# EAGLE design WeMos D1 mini (EAGLE 8.3.2)
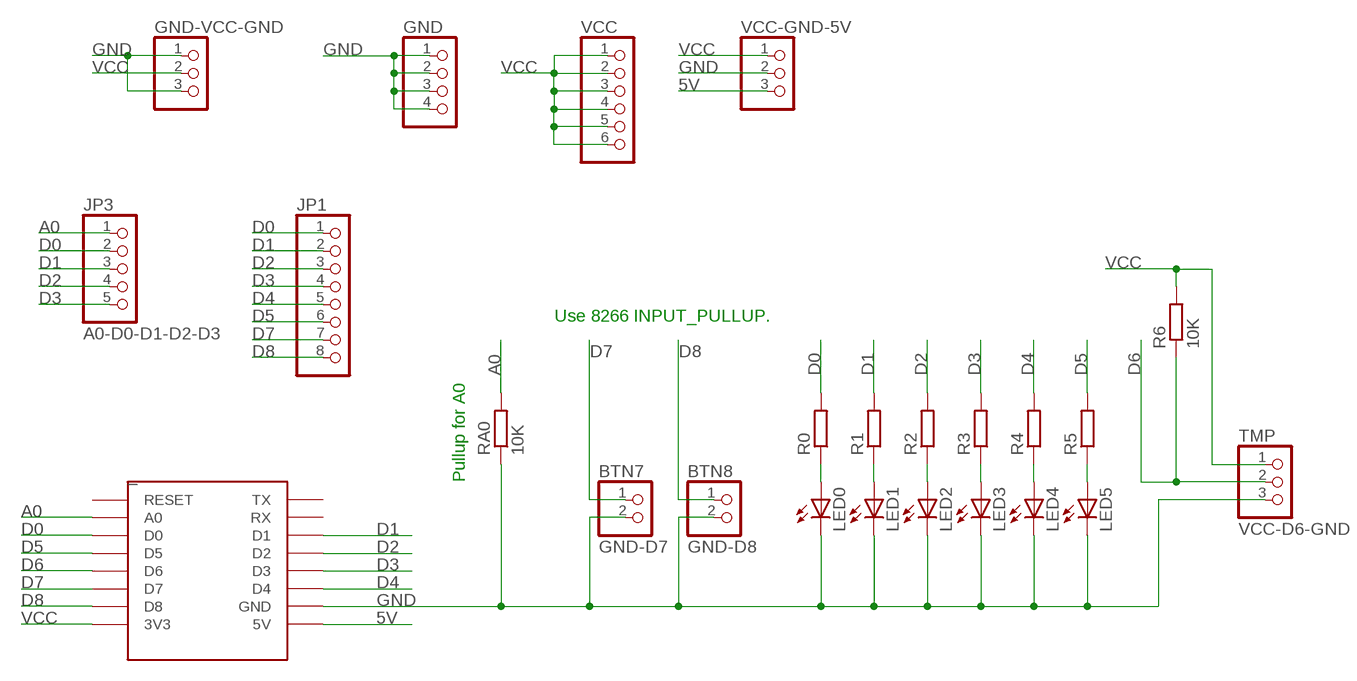
[diagram p0: schematic, sheet 1]

## Parts
_  WEMOS-D1-MINI  [WEMOS-D1-MINI]
BTN7  GND-D7  PINHD-1X2/OCT  [1X02/OCT]
BTN8  GND-D8  PINHD-1X2/OCT  [1X02/OCT]
GND  PINHD-1X4/OCT  [1X04/OCT]
GND-VCC-GND  PINHD-1X3/OCT  [1X03/OCT]
JP1  PINHD-1X8/OCT  [1X08/OCT]
JP3  A0-D0-D1-D2-D3  PINHD-1X5/OCT  [1X05/OCT]
LED0  LED3MM  [LED3MM]
LED1  LED3MM  [LED3MM]
LED2  LED3MM  [LED3MM]
LED3  LED3MM  [LED3MM]
LED4  LED3MM  [LED3MM]
LED5  LED3MM  [LED3MM]
R0  R-EU_0204/5  [0204/5]
R1  R-EU_0204/5  [0204/5]
R2  R-EU_0204/5  [0204/5]
R3  R-EU_0204/5  [0204/5]
R4  R-EU_0204/5  [0204/5]
R5  R-EU_0204/5  [0204/5]
R6  10K  R-EU_0204/5  [0204/5]
RA0  10K  R-EU_0204/5  [0204/5]
TMP  VCC-D6-GND  PINHD-1X3/OCT  [1X03/OCT]
VCC  PINHD-1X6/OCT  [1X06/OCT]
VCC-GND-5V  PINHD-1X3/OCT  [1X03/OCT]

## Nets
5V [power]: _.5V VCC-GND-5V.3
A0: _.A0 JP3.1 RA0.2
D0: _.D0 JP1.1 JP3.2 R0.2
D1: _.D1 JP1.2 JP3.3 R1.2
D2: _.D2 JP1.3 JP3.4 R2.2
D3: _.D3 JP1.4 JP3.5 R3.2
D4: _.D4 JP1.5 R4.2
D5: _.D5 JP1.6 R5.2
D6: _.D6 R6.1 TMP.2
D7: _.D7 BTN7.1 JP1.7
D8: _.D8 BTN8.1 JP1.8
GND [power]: _.GND BTN7.2 BTN8.2 GND-VCC-GND.1 GND-VCC-GND.3 GND.1 GND.2 GND.3 GND.4 LED0.K(C) LED1.K(C) LED2.K(C) LED3.K(C) LED4.K(C) LED5.K(C) RA0.1 TMP.3 VCC-GND-5V.2
N$1: LED5.A R5.1
N$2: LED4.A R4.1
N$3: LED3.A R3.1
N$4: LED2.A R2.1
N$5: LED1.A R1.1
N$6: LED0.A R0.1
VCC [power]: _.3V3 GND-VCC-GND.2 R6.2 TMP.1 VCC-GND-5V.1 VCC.1 VCC.2 VCC.3 VCC.4 VCC.5 VCC.6
Unconnected: _.RESET _.RX _.TX

## Notes on the sheet
- Use 8266 INPUT_PULLUP.
- Pullup for A0

## Library data of the parts
_ = esp8266modules:WEMOS-D1-MINI: WeMos.cc D1 mini ESP8266 module
BTN7 BTN8 = pinhead_v2:PINHD-1X2: PIN HEADER
GND = pinhead_v2:PINHD-1X4: PIN HEADER
GND-VCC-GND TMP VCC-GND-5V = pinhead_v2:PINHD-1X3: PIN HEADER
JP1 = pinhead_v2:PINHD-1X8: PIN HEADER
JP3 = pinhead_v2:PINHD-1X5: PIN HEADER
LED0 LED1-LED5 = led:LED: LED OSRAM: - CHIPLED LG R971, LG N971, LY N971, LG Q971, LY Q971, LO R971, LY R971 LH N974, LH R974 LS Q976, LO Q976, LY Q976 LO Q996 - Hyper CHIPLED LW Q18S LB Q993, LB Q99A, LB R99A - SideLED LS A670, LO A670, LY A670, LG A670, LP A670 LB A673, LV A673, LT A673, LW A673 LH A674 LY A675 LS A676, LA A676, LO A676, LY A676, LW A676 LS A679, LY A679, LG A679 - Hyper Micro SIDELED® LS Y876, LA Y876, LO Y876, LY Y876 LT Y87S - SmartLED LW L88C, LW L88S LB L89C, LB L89S, LG L890 LS L89K, LO L89K, LY L89K LS L896, LA L896, LO L896, LY L896 - TOPLED LS T670, LO T670, LY T670, LG T670, LP T670 LSG T670, LSP T670, LSY T670, LOP T670, LYG T670 LG T671, LOG T671, LSG T671 LB T673, LV T673, LT T673, LW T673 LH T674 LS T676, LA T676, LO T676, LY T676, LB T676, LH T676, LSB T676, LW T676 LB T67C, LV T67C, LT T67C, LS T67K, LO T67K, LY T67K, LW E67C LS E67B, LA E67B, LO E67B, LY E67B, LB E67C, LV E67C, LT E67C LW T67C LS T679, LY T679, LG T679 LS T770, LO T770, LY T770, LG T770, LP T770 LB T773, LV T773, LT T773, LW T773 LH T774 LS E675, LA E675, LY E675, LS T675 LS T776, LA T776, LO T776, LY T776, LB T776 LHGB T686 LT T68C, LB T68C - Hyper Mini TOPLED® LB M676 - Mini TOPLED Santana® LG M470 LS M47K, LO M47K, LY M47K Source: http://www.osram.convergy.de LUXEON: - LUMILED® LXK2-PW12-R00, LXK2-PW12-S00, LXK2-PW14-U00, LXK2-PW14-V00 LXK2-PM12-R00, LXK2-PM12-S00, LXK2-PM14-U00 LXK2-PE12-Q00, LXK2-PE12-R00, LXK2-PE12-S00, LXK2-PE14-T00, LXK2-PE14-U00 LXK2-PB12-K00, LXK2-PB12-L00, LXK2-PB12-M00, LXK2-PB14-N00, LXK2-PB14-P00, LXK2-PB14-Q00 LXK2-PR12-L00, LXK2-PR12-M00, LXK2-PR14-Q00, LXK2-PR14-R00 LXK2-PD12-Q00, LXK2-PD12-R00, LXK2-PD12-S00 LXK2-PH12-R00, LXK2-PH12-S00 LXK2-PL12-P00, LXK2-PL12-Q00, LXK2-PL12-R00 Source: www.luxeon.com KINGBRIGHT: KA-3528ASYC Source: www.kingbright.com
R0 R1-R6 RA0 = resistor:R-EU_: RESISTOR, European symbol
VCC = pinhead_v2:PINHD-1X6: PIN HEADER

## Net classes
1 power: width 0.381 mm

## Board
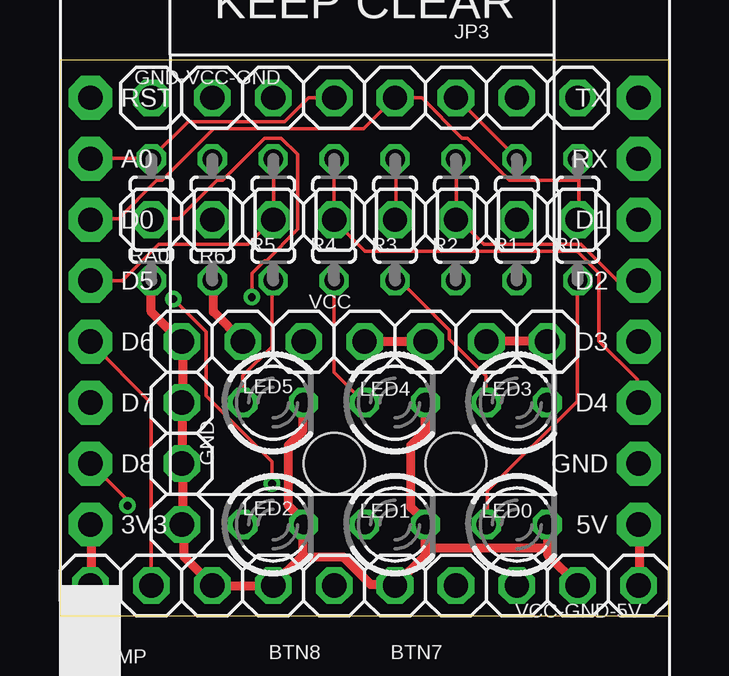
[diagram p1: board, top side]
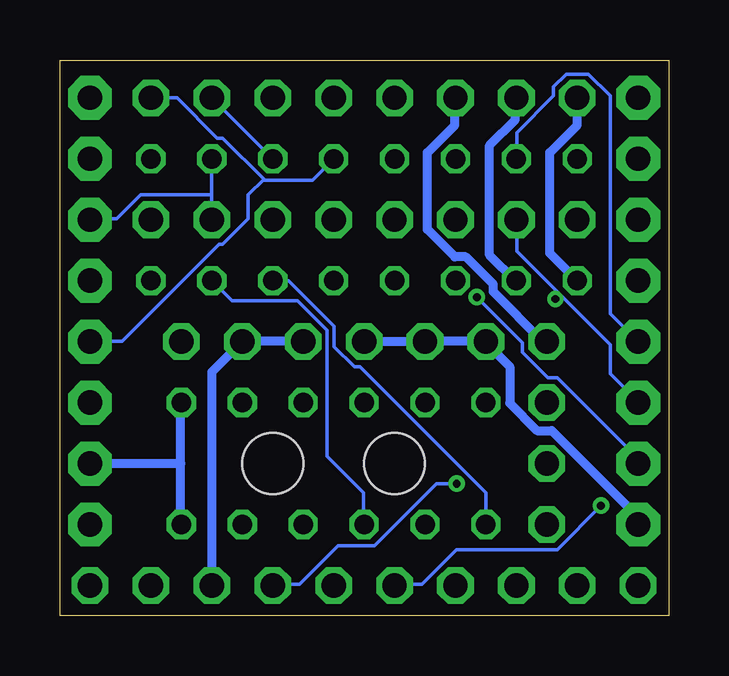
[diagram p2: board, bottom side, seen from below]

Size 25.38 x 23.16 mm. Coordinates in mm from the lower left corner, seen from the top.
Outline: 0,0 25.38,0 25.38,23.16 0,23.16 0,0
Copper layers (1*16): Top 0.0356mm / dielectric 1.5011mm / Bottom 0.0356mm
Design rules "PCBs_io": minimum track width 6mil, minimum drill 13mil, track to track 6mil, track to pad 6mil, pad to pad 6mil, via to via 6mil, smd to smd 6mil, copper to edge 15mil, drill to drill 6mil, minimum pad ring 7mil, minimum via ring 7mil, stop-mask expansion 3mil, vias tented up to drill 0mil, thermal gap 10mil
Holes 2.54 mm at 11.43,6.35 16.51,6.35

### Footprints (pad centres in the part's own frame; a part is rotated, then mirrored left to right if it is on the bottom)
WEMOS-D1-MINI = drill 1.016 pad 1.829 octagon: 3V3 -10.16,-10.16; 5V 12.7,-10.16; A0 -10.16,5.08; D0 -10.16,2.54; D1 12.7,2.54; D2 12.7,0; D3 12.7,-2.54; D4 12.7,-5.08; D5 -10.16,0; D6 -10.16,-2.54; D7 -10.16,-5.08; D8 -10.16,-7.62; GND 12.7,-7.62; RESET -10.16,7.62; RX 12.7,5.08; TX 12.7,7.62
1X02/OCT = drill 1.016 octagon: 1 -1.27,0; 2 1.27,0
1X04/OCT = drill 1.016 octagon: 1 -3.81,0; 2 -1.27,0; 3 1.27,0; 4 3.81,0
1X03/OCT = drill 1.016 octagon: 1 -2.54,0; 2 0,0; 3 2.54,0
1X08/OCT = drill 1.016 octagon: 1 -8.89,0; 2 -6.35,0; 3 -3.81,0; 4 -1.27,0; 5 1.27,0; 6 3.81,0; 7 6.35,0; 8 8.89,0
1X05/OCT = drill 1.016 octagon: 1 -5.08,0; 2 -2.54,0; 3 0,0; 4 2.54,0; 5 5.08,0
LED3MM = drill 0.813 octagon: A -1.27,0; K 1.27,0
0204/5 = drill 0.813 octagon: 1 -2.54,0; 2 2.54,0
1X06/OCT = drill 1.016 octagon: 1 -6.35,0; 2 -3.81,0; 3 -1.27,0; 4 1.27,0; 5 3.81,0; 6 6.35,0

### Placement (x,y rotation side)
_  11.43,13.97 0 top
BTN7  15.24,1.27 180 top
BTN8  10.16,1.27 180 top
GND  5.08,7.62 90 top
GND-VCC-GND  6.35,21.59 0 top
JP1  12.7,16.51 180 top
JP3  16.51,21.59 0 top
LED0  19.05,3.81 0 top
LED1  13.97,3.81 0 top
LED2  8.89,3.81 0 top
LED3  19.05,8.89 0 top
LED4  13.97,8.89 0 top
LED5  8.89,8.89 0 top
R0  21.59,16.51 90 top
R1  19.05,16.51 90 top
R2  16.51,16.51 90 top
R3  13.97,16.51 90 top
R4  11.43,16.51 90 top
R5  8.89,16.51 90 top
R6  6.35,16.51 270 top
RA0  3.81,16.51 90 top
TMP  3.81,1.27 0 top
VCC  13.97,11.43 0 top
VCC-GND-5V  21.59,1.27 0 top

### Tracks (layer width: path | path; a pad name or v marks a point on that pad's centre or on a via)
5V
  Top 0.381: VCC-GND-5V.3 24.16,1.32 24.16,3.76 _.5V
A0
  Top 0.152: 3.81,19.08 1.29,19.08 _.A0 | JP3.1 10.36,21.59 9.37,20.6 5.33,20.6 3.81,19.08 | 3.81,19.08 RA0.2
D0
  Top 0.152: 21.64,18.16 21.64,16.56 JP1.1 | 21.64,18.16 21.64,19 R0.2 | 21.64,18.16 18.75,18.16 16.99,19.91 16.76,19.91 15.09,21.59 JP3.2 13.95,21.59 12.65,20.3 6.4,20.3 4.27,18.16 4.04,18.16 2.44,16.56 1.29,16.56 _.D0
D1
  Top 0.152: JP3.3 16.54,21.59 19.05,19.08 R1.2
  Bottom 0.152: JP1.2 19.05,17.55 | 19.05,17.55 R1.2 | 19.05,17.55 22.02,17.55 23.01,16.56 24.08,16.56 _.D1
D2
  Top 0.152: R2.2 16.54,19 16.54,16.56 JP1.3 16.61,16.56 17.68,15.49 21.72,15.49 23.24,13.97 _.D2
  Bottom 0.152: R2.2 JP3.4
D3
  Top 0.152: R3.2 14.02,19 14.02,16.56 JP1.4
  Bottom 0.152: JP3.5 20.5,21.59 18.82,19.91 18.59,19.91 16.88,18.2 | 16.88,18.2 16.84,18.16 14.86,18.16 R3.2 | 16.88,18.2 17.53,17.55 17.53,16.56 18.59,15.49 18.75,15.49 22.78,11.46 24.08,11.46 _.D3
D4
  Top 0.152: R4.2 JP1.5 11.43,16.48 12.72,15.19 21.57,15.19 22.48,14.28 22.48,11.46 24.08,9.86 24.08,8.94 _.D4
D5
  Top 0.152: R5.2 8.91,19 8.91,16.56 JP1.6 8.84,16.48 7.85,15.49 4.12,15.49 2.59,13.97 _.D5
D6
  Top 0.152: TMP.2 3.81,8.87 1.29,11.38 _.D6
  Bottom 0.152: _.D6 2.44,12.6 2.44,21.67 3.35,22.58 4.27,22.58 4.8,22.05 4.8,21.67 6.33,20.14 6.33,19.08 R6.1
D7  (via drill 0.33)
  Top 0.152: v8.84,5.51 8.84,6.43 6.1,9.17 6.1,11.84 v4.72,13.21
  Bottom 0.152: 4.53,13.4 2.44,11.3 2.44,10.08 1.29,8.94 _.D7 | 4.53,13.4 6.33,15.19 6.33,16.48 JP1.7 | v8.84,5.51 9.68,5.51 12.27,2.92 13.79,2.92 15.39,1.32 16.46,1.32 BTN7.1 | 4.53,13.4 v4.72,13.21
D8  (via drill 0.33)
  Top 0.152: v8,13.28 8,14.28 8.53,14.81 8.61,14.81 9.91,16.1 9.91,19.23 9.22,19.91 8.53,19.91 6.78,18.16 6.55,18.16 4.95,16.56 3.81,16.56 JP1.8 | v2.82,4.6 2.82,4.83 1.29,6.35 _.D8
  Bottom 0.152: v8,13.28 6.1,11.38 6.1,11 5.03,9.93 4.65,9.93 1.29,6.58 1.29,6.35 _.D8 | v2.82,4.6 4.65,2.77 8.84,2.77 10.29,1.32 11.43,1.32 BTN8.1
GND
  Top 0.381: RA0.1 3.81,12.67 5.03,11.46 GND.4 5.11,11.3 5.11,9.02 GND.3 5.11,8.87 5.11,6.5 GND.2 5.11,6.35 5.11,3.83 GND.1 5.18,3.68 5.18,2.46 6.25,1.4 TMP.3 6.4,1.25 8.76,1.25 BTN8.2 8.91,1.32 10.13,2.54 | 20.34,2.84 20.34,2.54 21.57,1.32 VCC-GND-5V.2 | 20.34,2.84 20.34,3.76 LED0.K | 15.24,2.84 15.24,2.54 BTN7.2 13.79,1.32 12.95,1.32 11.81,2.46 10.29,2.46 10.13,2.54 | 15.24,2.84 LED1.K 15.16,3.99 14.63,4.52 14.63,7.11 15.24,7.72 LED4.K | 10.13,2.54 10.13,3.76 LED2.K 10.13,3.99 9.53,4.6 9.53,7.11 10.13,7.72 10.13,8.87 LED5.K | 15.24,2.84 20.34,2.84
  Bottom 0.381: GND-VCC-GND.1 3.81,20.45 4.95,19.3 4.95,15.11 RA0.1 | GND-VCC-GND.3 8.91,21.59 8.91,20.45 10.06,19.3 10.06,16.1 8.91,14.96 8.46,14.96 7.32,13.82 7.32,13.51 5.26,11.46 5.11,11.46 GND.4 | 20.34,6.35 20.34,3.83 LED0.K | 20.34,6.35 20.34,8.87 LED3.K | 20.34,6.35 _.GND
N$1
  Top 0.152: LED5.A 7.62,10.01 8.84,11.23 8.84,13.97 R5.1
N$2
  Top 0.152: R4.1 11.43,10.16 LED4.A
N$3
  Top 0.152: R3.1 14.17,13.97 16.23,11.91 16.23,11.53 17.75,10.01 17.75,8.94 LED3.A
N$4
  Bottom 0.152: LED2.A 7.62,5.13 12.88,10.39 13.11,10.39 13.95,11.23 13.95,12.06 15.85,13.97 R2.1
N$5
  Bottom 0.152: R1.1 18.21,13.13 15.47,13.13 14.25,11.91 14.25,6.65 12.72,5.13 12.72,3.83 LED1.A
N$6
  Top 0.152: LED0.A 17.83,3.83 17.83,5.21 21.57,8.94 21.57,13.97 R0.1
VCC
  Top 0.381: VCC.5 17.83,11.46 20.27,11.46 VCC.6 | VCC.4 15.24,11.46 12.72,11.46 VCC.3 | TMP.1 1.29,1.32 1.29,3.76 _.3V3 | R6.2 6.4,13.97 6.4,12.67 7.62,11.46 VCC.1
  Bottom 0.381: VCC-GND-5V.1 19.05,10.16 VCC.5 17.6,11.46 15.24,11.46 VCC.4 | VCC.3 12.65,11.46 10.21,11.46 VCC.2 9.98,11.46 7.77,11.46 VCC.1 7.62,11.38 6.63,10.39 6.63,8.87 5.49,7.72 4.88,7.72 1.29,4.14 1.29,3.83 _.3V3 | GND-VCC-GND.2 6.4,21.59 6.4,20.68 7.47,19.61 7.47,15.04 6.4,13.97 R6.2